# Altium project OV7670 Shield 08.PrjPcb
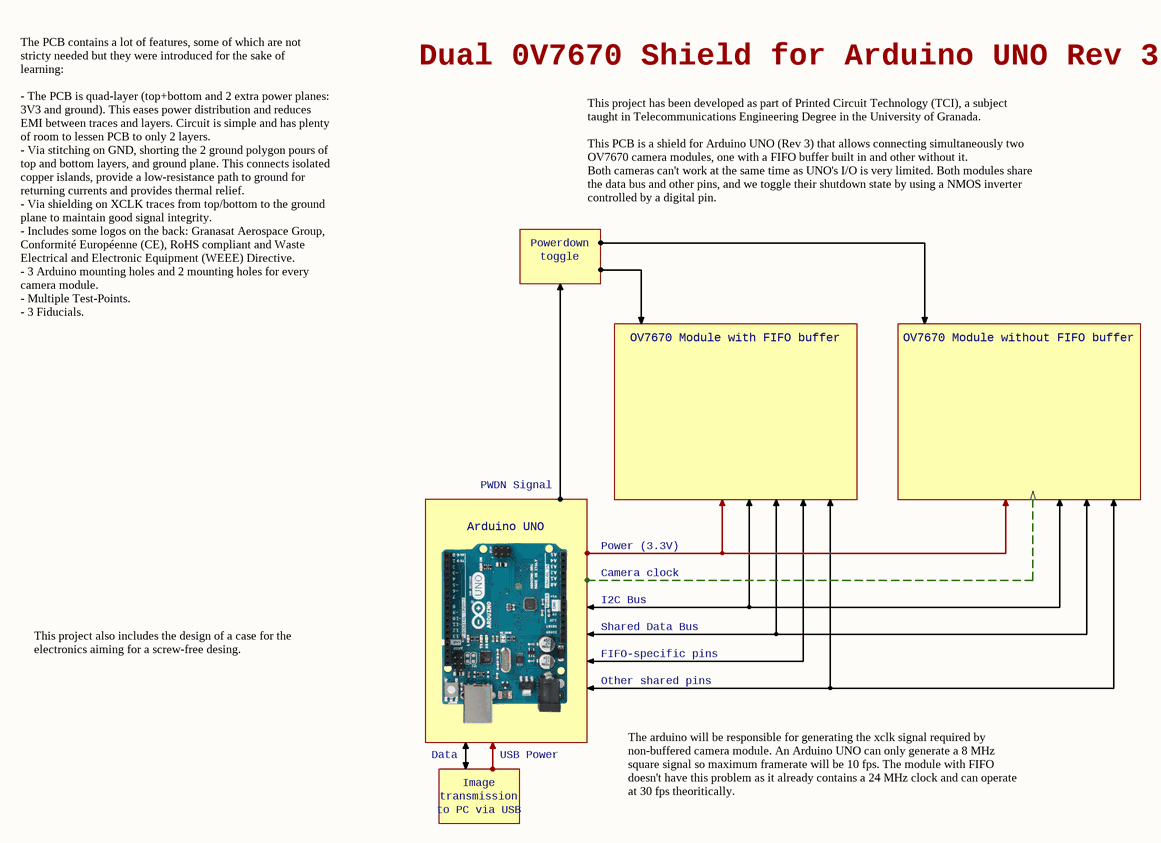
[diagram p0: introduction.SchDoc]
Author: Juan del Pino Mena; Title: Dual OV7670 Shield for Arduino UNO Rev 3
3 sheets, 35 parts. Net scope: global (net labels, ports and power ports of the same name join across sheets).
Board file: ShieldPCB.PcbDoc
Sheets:
  introduction.SchDoc
  arduino_connections.SchDoc
  OV7670_headers.SchDoc

## Sheet introduction.SchDoc: Introduction
size A4; Date: 2022-01-17; Author: Juan del Pino Mena; CompanyName: TCI; DrawnBy: Juan del Pino Mena; Engineer: Juan del Pino Mena; Organization: UGR; Revision: 0.8; SheetNumber: 1; SheetTotal: 3

### Notes on the sheet
- Dual 0V7670 Shield for Arduino UNO Rev 3
- This project has been developed as part of Printed Circuit Technology (TCI), a subject taught in Telecommunications Engineering Degree in the University of Granada.
  This PCB is a shield for Arduino UNO (Rev 3) that allows connecting simultaneously two OV7670 camera modules, one with a FIFO buffer built in and other without it.
  Both cameras can't work at the same time as UNO's I/O is very limited. Both modules share the data bus and other pins, and we toggle their shutdown state by using a NMOS inverter controlled by a digital pin.
- Powerdown
- toggle
- The PCB contains a lot of features, some of which are not stricty needed but they were introduced for the sake of learning:
  - The PCB is quad-layer (top+bottom and 2 extra power planes: 3V3 and ground). This eases power distribution and reduces EMI between traces and layers. Circuit is simple and has plenty of room to lessen PCB to only 2 layers.
  - Via stitching on GND, shorting the 2 ground polygon pours of top and bottom layers, and ground plane. This connects isolated copper islands, provide a low-resistance path to ground for returning currents and provides thermal relief.
  - Via shielding on XCLK traces from top/bottom to the ground plane to maintain good signal integrity.
  - Includes some logos on the back: Granasat Aerospace Group, Conformité Européenne (CE), RoHS compliant and Waste Electrical and Electronic Equipment (WEEE) Directive.
  - 3 Arduino mounting holes and 2 mounting holes for every camera module.
  - Multiple Test-Points.
  - 3 Fiducials.
- OV7670 Module with FIFO buffer
- OV7670 Module without FIFO buffer
- PWDN Signal
- Arduino UNO
- Power (3.3V)
- I2C Bus
- Camera clock
- This project also includes the design of a case for the electronics aiming for a screw-free desing.
- Shared Data Bus
- FIFO-specific pins
- Other shared pins
- Data
- USB Power
- to PC via USB
- transmission
- Image
- The arduino will be responsible for generating the xclk signal required by non-buffered camera module. An Arduino UNO can only generate a 8 MHz square signal so maximum framerate will be 10 fps. The module with FIFO doesn't have this problem as it already contains a 24 MHz clock and can operate at 30 fps theoritically.
- Designer's signature
- Sheet title:
- Dpto. Electrónica y Tecnología
- de Computadores
- Supervisor's signature
- Project title:
- Desginer:
- University of Granada
- C/ Fuente Nueva, s/n, 18001
- Granada, Granada, Spain
- Sr. Andrés Roldán Aranda
- Date:
- Revision:
- Sheet
- of

## Sheet arduino_connections.SchDoc: Arduino Connections
size A4; Date: 2022-01-17; Author: Juan del Pino Mena; CompanyName: TCI; DrawnBy: Juan del Pino Mena; Engineer: Juan del Pino Mena; Organization: UGR; DocumentNumber: 1; Revision: 0.8; SheetNumber: 2; SheetTotal: 3
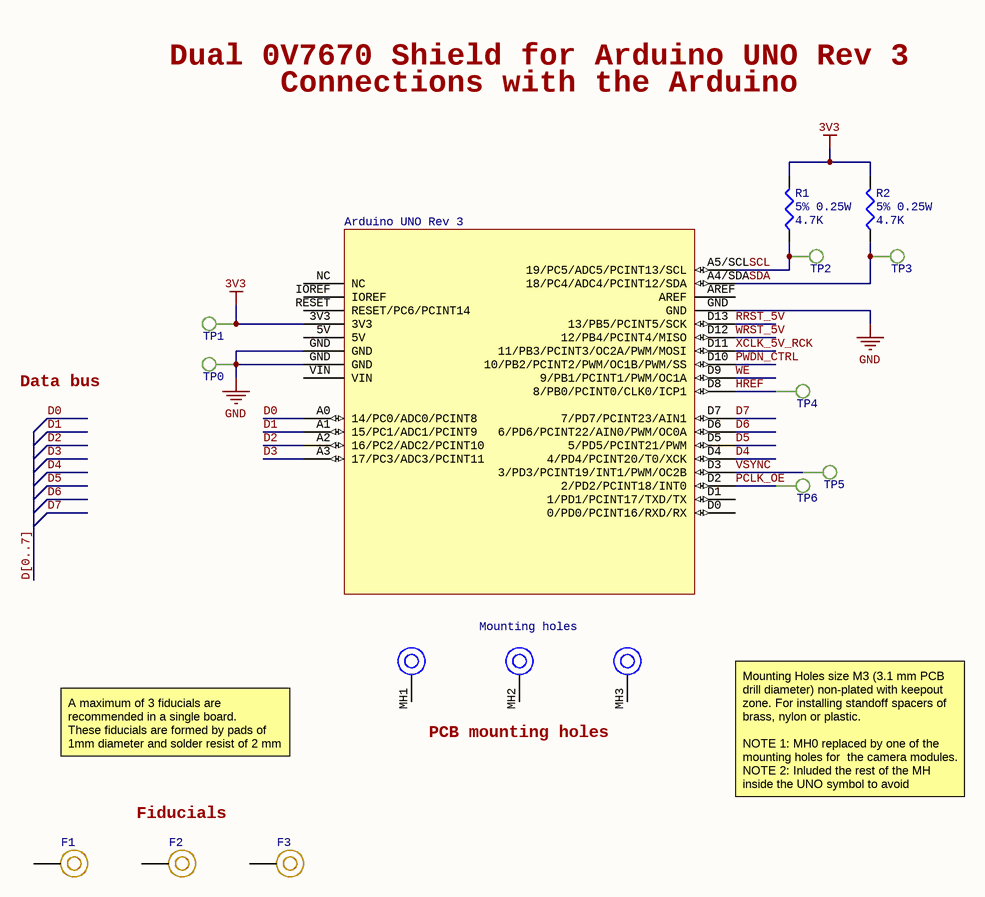
[diagram p1: arduino_connections.SchDoc]

### Parts
F1  Fiducial_1mm_2mm  [FIDUCIAL_1MM_2MM]  (value not drawn)
F2  Fiducial_1mm_2mm  [FIDUCIAL_1MM_2MM]  (value not drawn)
F3  Fiducial_1mm_2mm  [FIDUCIAL_1MM_2MM]  (value not drawn)
MCU1  Arduino UNO Rev 3  [Arduino UNO Rev 3]
R1  5% 0.25W  value 4.7K  [0603 RES]
R2  5% 0.25W  value 4.7K  [0603 RES]
TP0  Test Point Pad  [TEST POINT PAD]  (value not drawn)
TP1  Test Point Pad  [TEST POINT PAD]  (value not drawn)
TP2  Test Point Pad  [TEST POINT PAD]  (value not drawn)
TP3  Test Point Pad  [TEST POINT PAD]  (value not drawn)
TP4  Test Point Pad  [TEST POINT PAD]  (value not drawn)
TP5  Test Point Pad  [TEST POINT PAD]  (value not drawn)
TP6  Test Point Pad  [TEST POINT PAD]  (value not drawn)

### Nets
3V3: MCU1.3V3 R1.2 R2.2 TP1.1
GND: MCU1.GND TP0.1
D0: MCU1.A0(14/PC0/ADC0/PCINT8)
D1: MCU1.A1(15/PC1/ADC1/PCINT9)
D2: MCU1.A2(16/PC2/ADC2/PCINT10)
D3: MCU1.A3(17/PC3/ADC3/PCINT11)
D4: MCU1.D4(4/PD4/PCINT20/T0/XCK)
D5: MCU1.D5(5/PD5/PCINT21/PWM)
D6: MCU1.D6(6/PD6/PCINT22/AIN0/PWM/OC0A)
D7: MCU1.D7(7/PD7/PCINT23/AIN1)
HREF: MCU1.D8(8/PB0/PCINT0/CLK0/ICP1) TP4.1
PCLK_OE: MCU1.D2(2/PD2/PCINT18/INT0) TP6.1
PWDN_CTRL: MCU1.D10(10/PB2/PCINT2/PWM/OC1B/PWM/SS)
RRST_5V: MCU1.D13(13/PB5/PCINT5/SCK)
SCL: MCU1.A5/SCL(19/PC5/ADC5/PCINT13/SCL) R1.1 TP2.1
SDA: MCU1.A4/SDA(18/PC4/ADC4/PCINT12/SDA) R2.1 TP3.1
VSYNC: MCU1.D3(3/PD3/PCINT19/INT1/PWM/OC2B) TP5.1
WE: MCU1.D9(9/PB1/PCINT1/PWM/OC1A)
WRST_5V: MCU1.D12(12/PB4/PCINT4/MISO)
XCLK_5V_RCK: MCU1.D11(11/PB3/PCINT3/OC2A/PWM/MOSI)

Not connected (* = marked no-connect by the designer): F1 1; F2 1; F3 1; MCU1 5V AREF D0(0/PD0/PCINT16/RXD/RX) D1(1/PD1/PCINT17/TXD/TX) IOREF MH1 MH2 MH3 NC RESET(RESET/PC6/PCINT14) VIN

### Buses and harness runs
bus D[0..7]

### Notes on the sheet
- Dual 0V7670 Shield for Arduino UNO Rev 3
- Connections with the Arduino
- Data bus
- A maximum of 3 fiducials are recommended in a single board.
  These fiducials are formed by pads of 1mm diameter and solder resist of 2 mm diameter
- (near MCU1) PCB mounting holes
- (near F2) Fiducials
- (near MCU1) Mounting Holes size M3 (3.1 mm PCB drill diameter) non-plated with keepout zone. For installing standoff spacers of brass, nylon or plastic.
  NOTE 1: MH0 replaced by one of the mounting holes for  the camera modules.
  NOTE 2: Inluded the rest of the MH inside the UNO symbol to avoid collisions with spacers.
- Designer's signature
- Sheet title:
- Dpto. Electrónica y Tecnología
- de Computadores
- Supervisor's signature
- Project title:
- Desginer:
- University of Granada
- C/ Fuente Nueva, s/n, 18001
- Granada, Granada, Spain
- Sr. Andrés Roldán Aranda
- Date:
- Revision:
- Sheet
- of
- (in symbol Arduino UNO Rev 3) Mounting holes

### Library data of the parts
F1-F3 = Fiducial_1mm_2mm: Fiducial 1mm pad, 2mm solder resist
MCU1 = Arduino UNO Rev 3: Arduino UNO Rev 3 pinout
R1 R2 = Res4K7: SMD Resistor 4.7 KOhm 5% 0.1W 0603; Published: 8-Jun-2000; LatestRevisionDate: 29-May-2009; LatestRevisionNote: IPC-7351 Footprint Added.; PackageReference: J1-0603; Publisher: Altium Limited; PackageDescription: Chip Resistor
TP0-TP6 = Test Point Pad: Test point - PCB Pad type.

## Sheet OV7670_headers.SchDoc: 0V7670 header connections and voltage conversion
size A4; Date: 2022-01-17; Author: Juan del Pino Mena; CompanyName: TCI; Engineer: Juan del Pino Mena; Organization: UGR; Revision: 0.8; SheetNumber: 3; SheetTotal: 3
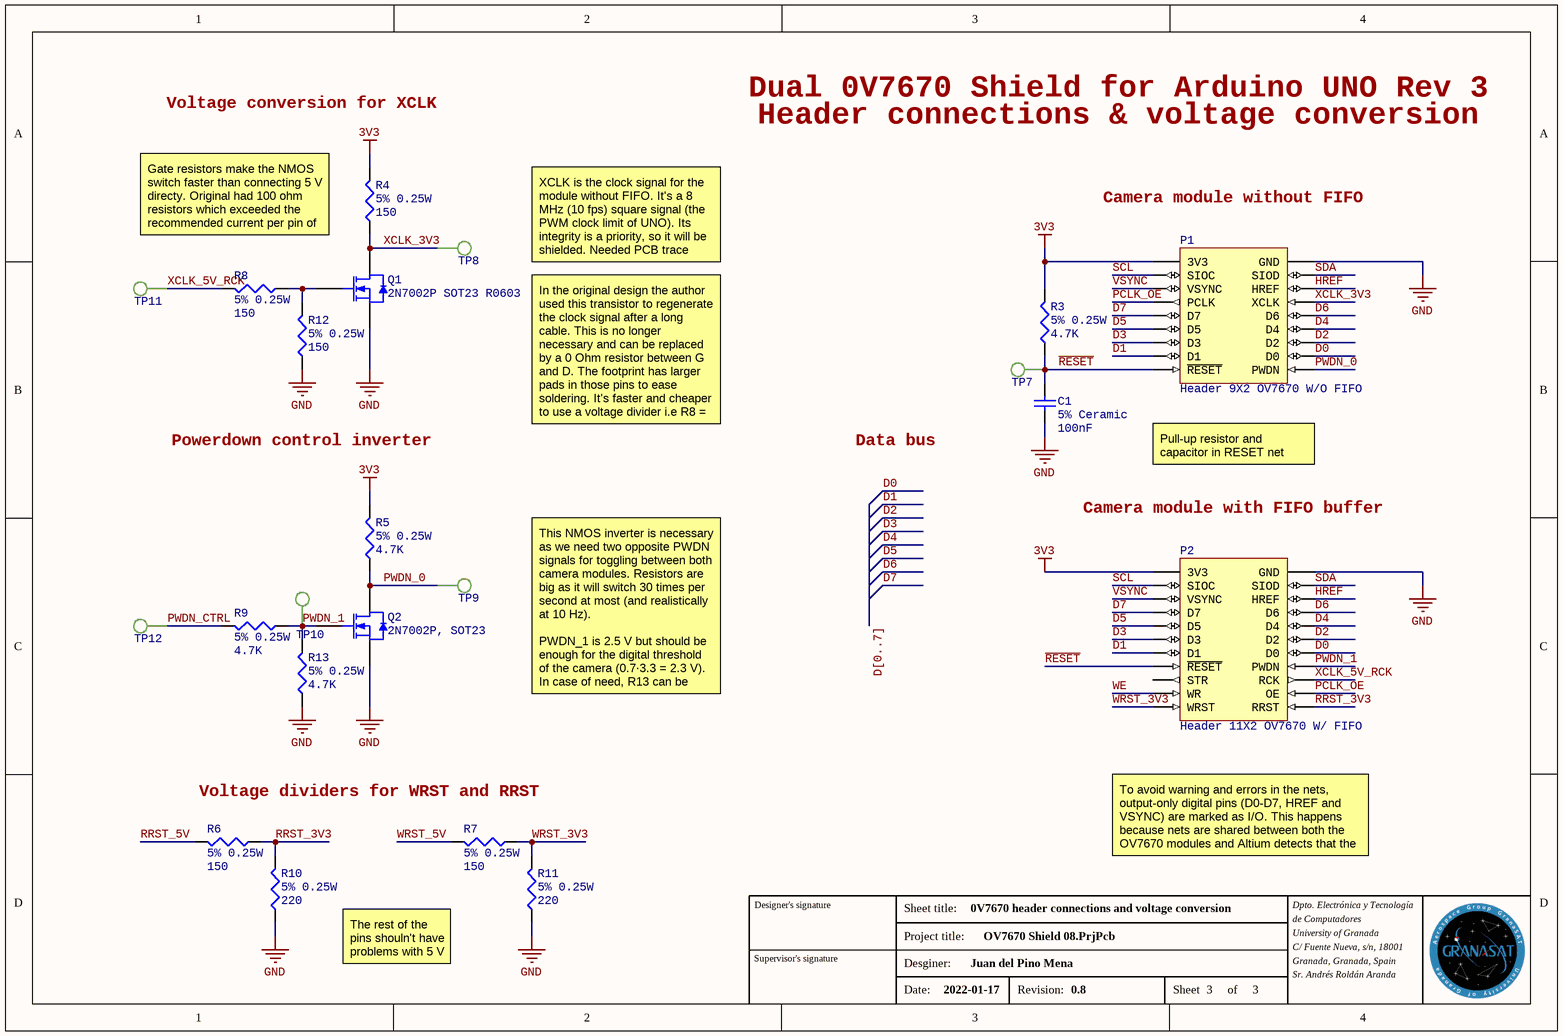
[diagram p2: OV7670_headers.SchDoc]

### Parts
C1  5% Ceramic  value 100nF  [0805 CAP]
P1  Header 9X2 OV7670 W/O FIFO  [9x2 PIN HEADER]
P2  Header 11X2 OV7670 W/ FIFO  [11x2 PIN HEADER]
Q1  2N7002P SOT23 R0603  [2N7002P SOT23 WITH LARGE G,D PADS]
Q2  2N7002P, SOT23  [2N7002P SOT23]
R3  5% 0.25W  value 4.7K  [0603 RES]
R4  5% 0.25W  value 150  [0603 RES]
R5  5% 0.25W  value 4.7K  [0603 RES]
R6  5% 0.25W  value 150  [0603 RES]
R7  5% 0.25W  value 150  [0603 RES]
R8  5% 0.25W  value 150  [0603 RES]
R9  5% 0.25W  value 4.7K  [0603 RES]
R10  5% 0.25W  value 220  [0603 RES]
R11  5% 0.25W  value 220  [0603 RES]
R12  5% 0.25W  value 150  [0603 RES]
R13  5% 0.25W  value 4.7K  [0603 RES]
TP7  Test Point Pad  [TEST POINT PAD]  (value not drawn)
TP8  Test Point Pad  [TEST POINT PAD]  (value not drawn)
TP9  Test Point Pad  [TEST POINT PAD]  (value not drawn)
TP10  Test Point Pad  [TEST POINT PAD]  (value not drawn)
TP11  Test Point Pad  [TEST POINT PAD]  (value not drawn)
TP12  Test Point Pad  [TEST POINT PAD]  (value not drawn)

### Nets
3V3: P1.1(3V3) P2.1(3V3) R3.2 R4.2 R5.2
GND: C1.1 P1.2(GND) P2.2(GND) Q1.3(S) Q2.3(S) R10.1 R11.1 R12.1 R13.1
D0: P1.16(D0) P2.14(D0)
D1: P1.15(D1) P2.13(D1)
D2: P1.14(D2) P2.12(D2)
D3: P1.13(D3) P2.11(D3)
D4: P1.12(D4) P2.10(D4)
D5: P1.11(D5) P2.9(D5)
D6: P1.10(D6) P2.8(D6)
D7: P1.9(D7) P2.7(D7)
HREF: P1.6(HREF) P2.6(HREF)
PCLK_OE: P1.7(PCLK) P2.20(OE)
PWDN_0: P1.18(PWDN) Q2.2(D) R5.1 TP9.1
PWDN_1: P2.16(PWDN) Q2.1(G) R9.1 R13.2 TP10.1
PWDN_CTRL: R9.2 TP12.1
~{RESET}: C1.2 P1.17(~{RESET}) P2.15(~{RESET}) R3.1 TP7.1
RRST_3V3: P2.22(RRST) R6.1 R10.2
RRST_5V: R6.2
SCL: P1.3(SIOC) P2.3(SIOC)
SDA: P1.4(SIOD) P2.4(SIOD)
VSYNC: P1.5(VSYNC) P2.5(VSYNC)
WE: P2.19(WR)
WRST_3V3: P2.21(WRST) R7.1 R11.2
WRST_5V: R7.2
XCLK_3V3: P1.8(XCLK) Q1.2(D) R4.1 TP8.1
XCLK_5V_RCK: P2.18(RCK) R8.2 TP11.1
NetQ1_1: Q1.1(G) R8.1 R12.2

Not connected (* = marked no-connect by the designer): P2 17(STR)

### Buses and harness runs
bus D[0..7]

### Notes on the sheet
- Voltage conversion for XCLK
- Dual 0V7670 Shield for Arduino UNO Rev 3
- Header connections & voltage conversion
- Gate resistors make the NMOS switch faster than connecting 5 V directy. Original had 100 ohm resistors which exceeded the recommended current per pin of 20 mA.
- Camera module without FIFO
- XCLK is the clock signal for the module without FIFO. It's a 8 MHz (10 fps) square signal (the PWM clock limit of UNO). Its integrity is a priority, so it will be shielded. Needed PCB trace bandwidth is over 40 MHz.
- Powerdown control inverter
- In the original design the author used this transistor to regenerate the clock signal after a long cable. This is no longer necessary and can be replaced by a 0 Ohm resistor between G and D. The footprint has larger pads in those pins to ease soldering. It's faster and cheaper to use a voltage divider i.e R8 = 150 Ohm and R12 = 220 Ohm (from 5 V to 3 V)
- Data bus
- Pull-up resistor and capacitor in RESET net  stabilizes voltage
- Camera module with FIFO buffer
- This NMOS inverter is necessary as we need two opposite PWDN signals for toggling between both camera modules. Resistors are big as it will switch 30 times per second at most (and realistically at 10 Hz).
  PWDN_1 is 2.5 V but should be enough for the digital threshold of the camera (0.7·3.3 = 2.3 V). In case of need, R13 can be changed by a 6.8 kOhm one.
- Voltage dividers for WRST and RRST
- To avoid warning and errors in the nets, output-only digital pins (D0-D7, HREF and VSYNC) are marked as I/O. This happens because nets are shared between both the OV7670 modules and Altium detects that the same net has 2 output ports.
- The rest of the pins shouln't have problems with 5 V
- Designer's signature
- Sheet title:
- Dpto. Electrónica y Tecnología
- de Computadores
- Supervisor's signature
- Project title:
- Desginer:
- University of Granada
- C/ Fuente Nueva, s/n, 18001
- Granada, Granada, Spain
- Sr. Andrés Roldán Aranda
- Date:
- Revision:
- Sheet
- of

### Library data of the parts
C1 = Cap100nF: SMD Ceramic Capacitor 100nF 5% 0805; Published: 8-Jun-2000; LatestRevisionDate: 17-Jul-2002; LatestRevisionNote: Re-released for DXP Platform.; PackageReference: RAD-0.3; Publisher: Altium Limited; PackageDescription: Radial Cap, Thru-Hole; 2 Leads; 0.3 in Pin Spacing
P1 = Header 9X2 OV7670 W/O FIFO: Header, 9-Pin, Dual row. Pinout of OV7670 module without FIFO buffer.; Publisher: Altium Limited
P2 = Header 11X2 OV7670 W/ FIFO: Header, 11-Pin, Dual row. Pinout of OV7670 module with FIFO buffer.; LatestRevisionDate: 17-Jul-2002; LatestRevisionNote: Re-released for DXP Platform.; Publisher: Altium Limited
Q1 = 2N7002P (0Ohm): N-Channel MOSFET 2N7002P SOT23 / version with footprint compatible with 0 Ohm 0603 resistor; Note: Pin 2 is electrically connected to pin 4.; Published: 8-Jun-2000; LatestRevisionDate: 17-Jul-2002; LatestRevisionNote: Re-released for DXP Platform.; DatasheetVersion: PD-9.814; PackageVersion: Feb-1997; PackageReference: TO-220AB; Publisher: Altium Limited; PackageDescription: TO, Thru-Hole, Vertical, Heatsink Mounted; 3 In-Line Leads; Pitch 2.54 mm; ComponentLink1Description: Manufacturer Link; ComponentLink1URL: http://www.irf.com/
Q2 = 2N7002P: N-Channel MOSFET 2N7002P SOT23; Note: Pin 2 is electrically connected to pin 4.; Published: 8-Jun-2000; LatestRevisionDate: 17-Jul-2002; LatestRevisionNote: Re-released for DXP Platform.; DatasheetVersion: PD-9.814; PackageVersion: Feb-1997; PackageReference: TO-220AB; Publisher: Altium Limited; PackageDescription: TO, Thru-Hole, Vertical, Heatsink Mounted; 3 In-Line Leads; Pitch 2.54 mm; ComponentLink1Description: Manufacturer Link; ComponentLink1URL: http://www.irf.com/
R3 R5 R9 R13 = Res4K7: SMD Resistor 4.7 KOhm 5% 0.1W 0603; Published: 8-Jun-2000; LatestRevisionDate: 29-May-2009; LatestRevisionNote: IPC-7351 Footprint Added.; PackageReference: J1-0603; Publisher: Altium Limited; PackageDescription: Chip Resistor
R4 R6-R8 R12 = Res150R: SMD Resistor 150 Ohm 5% 0.25W 0603; Published: 8-Jun-2000; LatestRevisionDate: 29-May-2009; LatestRevisionNote: IPC-7351 Footprint Added.; PackageReference: J1-0603; Publisher: Altium Limited; PackageDescription: Chip Resistor
R10 R11 = Res220R: SMD Resistor 220 Ohm 5% 0.25W 0603; Published: 8-Jun-2000; LatestRevisionDate: 29-May-2009; LatestRevisionNote: IPC-7351 Footprint Added.; PackageReference: J1-0603; Publisher: Altium Limited; PackageDescription: Chip Resistor
TP7-TP12 = Test Point Pad: Test point - PCB Pad type.

## Nets that join several sheets
3V3: arduino_connections (MCU1.3V3 R1.2 R2.2 TP1.1), OV7670_headers (5 pins)
GND: arduino_connections (MCU1.GND TP0.1), OV7670_headers (9 pins)
D0: arduino_connections (MCU1.A0), OV7670_headers (P1.16 P2.14)
D1: arduino_connections (MCU1.A1), OV7670_headers (P1.15 P2.13)
D2: arduino_connections (MCU1.A2), OV7670_headers (P1.14 P2.12)
D3: arduino_connections (MCU1.A3), OV7670_headers (P1.13 P2.11)
D4: arduino_connections (MCU1.D4), OV7670_headers (P1.12 P2.10)
D5: arduino_connections (MCU1.D5), OV7670_headers (P1.11 P2.9)
D6: arduino_connections (MCU1.D6), OV7670_headers (P1.10 P2.8)
D7: arduino_connections (MCU1.D7), OV7670_headers (P1.9 P2.7)
HREF: arduino_connections (MCU1.D8 TP4.1), OV7670_headers (P1.6 P2.6)
PCLK_OE: arduino_connections (MCU1.D2 TP6.1), OV7670_headers (P1.7 P2.20)
PWDN_CTRL: arduino_connections (MCU1.D10), OV7670_headers (R9.2 TP12.1)
RRST_5V: arduino_connections (MCU1.D13), OV7670_headers (R6.2)
SCL: arduino_connections (MCU1.A5/SCL R1.1 TP2.1), OV7670_headers (P1.3 P2.3)
SDA: arduino_connections (MCU1.A4/SDA R2.1 TP3.1), OV7670_headers (P1.4 P2.4)
VSYNC: arduino_connections (MCU1.D3 TP5.1), OV7670_headers (P1.5 P2.5)
WE: arduino_connections (MCU1.D9), OV7670_headers (P2.19)
WRST_5V: arduino_connections (MCU1.D12), OV7670_headers (R7.2)
XCLK_5V_RCK: arduino_connections (MCU1.D11), OV7670_headers (P2.18 R8.2 TP11.1)